# EAGLE design mainboard (EAGLE 7.6.0)
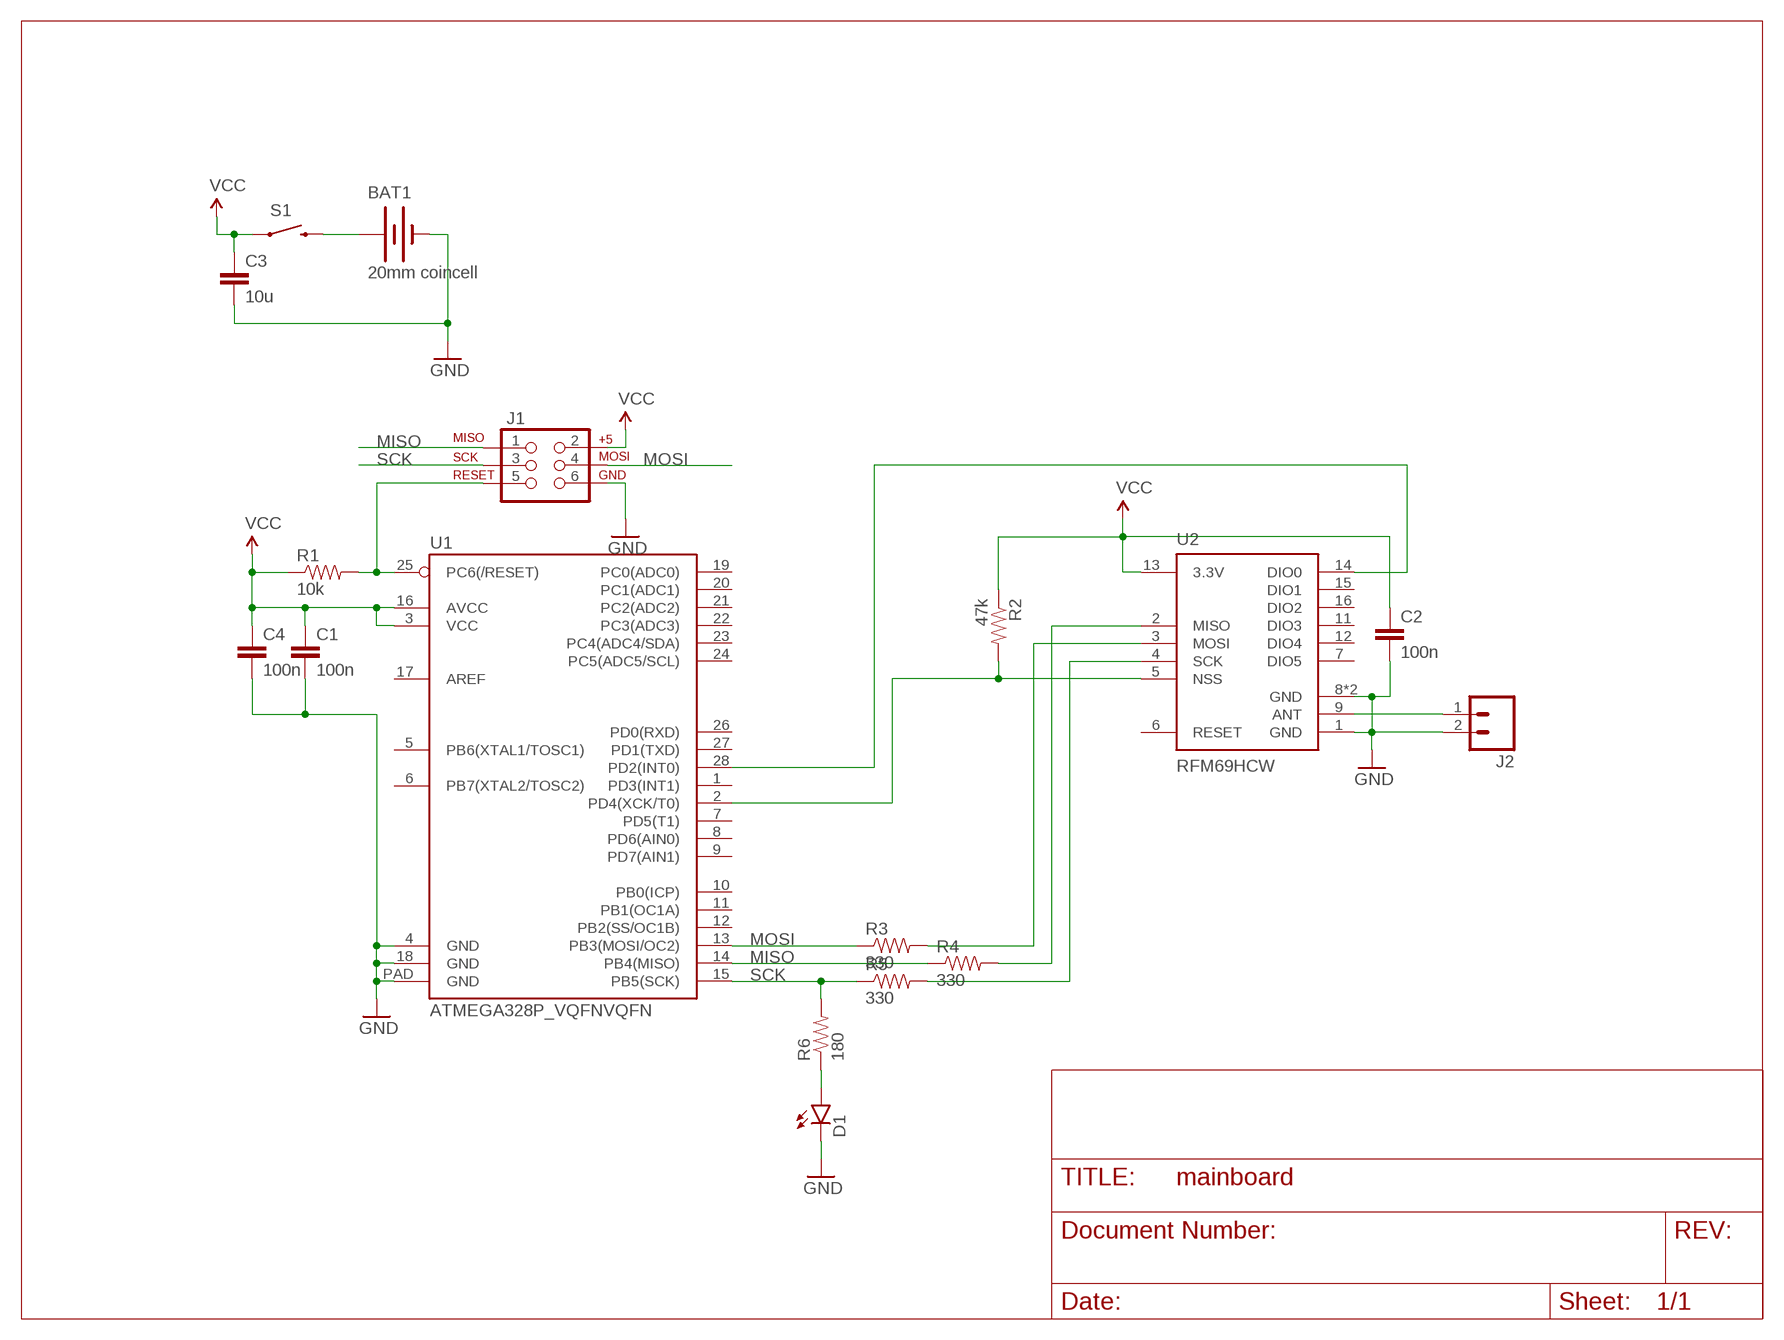
[diagram p0: schematic, sheet 1]

## Parts
BAT1  20mm coincell  BATTERY20MM_4LEGS  [BATTCON_20MM_4LEGS]
C1  100n  CAP0603-CAP  [0603-CAP]
C2  100n  CAP0603-CAP  [0603-CAP]
C3  10u  CAP1206  [1206]
C4  100n  CAP0603-CAP  [0603-CAP]
D1  LED0603  [LED-0603]
J1  AVR_SPI_PRG_6PTH  [2X3]
J2  M02PTH  [1X02]
R1  10k  RESISTOR0603-RES  [0603-RES]
R2  47k  RESISTOR0603-RES  [0603-RES]
R3  330  RESISTOR0603-RES  [0603-RES]
R4  330  RESISTOR0603-RES  [0603-RES]
R5  330  RESISTOR0603-RES  [0603-RES]
R6  180  RESISTOR0603-RES  [0603-RES]
S1  SWITCH-MOMENTARY-2PTH  [TACTILE-PTH]
U1  ATMEGA328P_VQFNVQFN  [VQFN-28]
U2  RFM69HCW  [RFM69HCW-XXXS2]

## Nets
GND: BAT1.NEGATIVE(-) C1.2 C2.2 C3.2 C4.2 D1.C J1.6 J2.2 U1.4(GND) U1.18(GND) U1.PAD(GND) U2.1(GND) U2.8(GND) U2.10(GND)
MISO: J1.1 R4.1 U1.14(PB4(MISO))
MOSI: J1.4 R3.1 U1.13(PB3(MOSI/OC2))
N$1: BAT1.POSITIVE@1(+) BAT1.POSITIVE@2(+) BAT1.POSITIVE@3(+) BAT1.POSITIVE@4(+) S1.3
N$2: J1.5 R1.2 U1.25(PC6(/RESET))
N$3: R3.2 U2.3(MOSI)
N$4: J2.1 U2.9(ANT)
N$5: R4.2 U2.2(MISO)
N$6: R2.2 U1.2(PD4(XCK/T0)) U2.5(NSS)
N$7: R5.2 U2.4(SCK)
N$8: U1.28(PD2(INT0)) U2.14(DIO0)
N$9: D1.A R6.1
SCK: J1.3 R5.1 R6.2 U1.15(PB5(SCK))
VCC: C1.1 C2.1 C3.1 C4.1 J1.2 R1.1 R2.1 S1.1 U1.3(VCC) U1.16(AVCC) U2.13(3.3V)
Unconnected: U1.1(PD3(INT1)) U1.5(PB6(XTAL1/TOSC1)) U1.6(PB7(XTAL2/TOSC2)) U1.7(PD5(T1)) U1.8(PD6(AIN0)) U1.9(PD7(AIN1)) U1.10(PB0(ICP)) U1.11(PB1(OC1A)) U1.12(PB2(SS/OC1B)) U1.17(AREF) U1.19(PC0(ADC0)) U1.20(PC1(ADC1)) U1.21(PC2(ADC2)) U1.22(PC3(ADC3)) U1.23(PC4(ADC4/SDA)) U1.24(PC5(ADC5/SCL)) U1.26(PD0(RXD)) U1.27(PD1(TXD)) U2.6(RESET) U2.7(DIO5) U2.11(DIO3) U2.12(DIO4) U2.15(DIO1) U2.16(DIO2)

## Library data of the parts
BAT1 = SparkFun-Electromechanical:BATTERY: Battery Holders Various common sizes : AA, AAA, 18650 (PRT-12895), 20mm coin cell and 12mm coin cell. 20MM_4LEGS, BATT-10373; PROD_ID: BATT-10373
C1-C4 = SparkFun-Passives:CAP: Capacitor Standard 0603 ceramic capacitor, and 0.1" leaded capacitor.
D1 = SparkFun-LED:LED: LEDs Standard schematic elements and footprints for 5mm, 3mm, 1206, and 0603 sized LEDs. 5mm - Spark Fun Electronics SKU : COM-00529 (and others)
J1 = SparkFun-Connectors:AVR_SPI_PRG_6: AVR ISP 6 Pin This is the reduced ISP connector for AVR programming. Common on Arduino. This footprint will take up less PCB space and can be used with a 10-pin to 6-pin adapter such as SKU: BOB-08508 **Special note about "TEST_POINT" package. The stop mask is on the top side, so if you want your programming test points to be on the bottom of your board, make sure to place this package on the bottom side of the board. This also ensure that the orientation to program from the bottom side will be correct.
J2 = SparkFun-Connectors:M02: Standard 2-pin 0.1" header. Use with - straight break away headers ( PRT-00116) - right angle break away headers (PRT-00553) - swiss pins (PRT-00743) - machine pins (PRT-00117) - female headers (PRT-00115) Molex polarized connector foot print use with: PRT-08233 with associated crimp pins and housings. 2.54_SCREWTERM for use with PRT-10571. 3.5mm Screw Terminal footprints for PRT-08084 5mm Screw Terminal footprints for use with PRT-08432
R1-R6 = SparkFun-Passives:RESISTOR: Resistor Basic schematic elements and footprints for 0603, 1206, and PTH resistors.
S1 = SparkFun-Electromechanical:SWITCH-MOMENTARY-2: Various NO switches- pushbuttons, reed, etc; PROD_ID: SWCH-08441
U1 = SparkFun-DigitalIC:ATMEGA328P_VQFN
U2 = SparkFun-RF:RFM69H; PROD_ID: IC-11997, IC-12053

## Net classes
0 default: clearance 0.205 mm

## Board
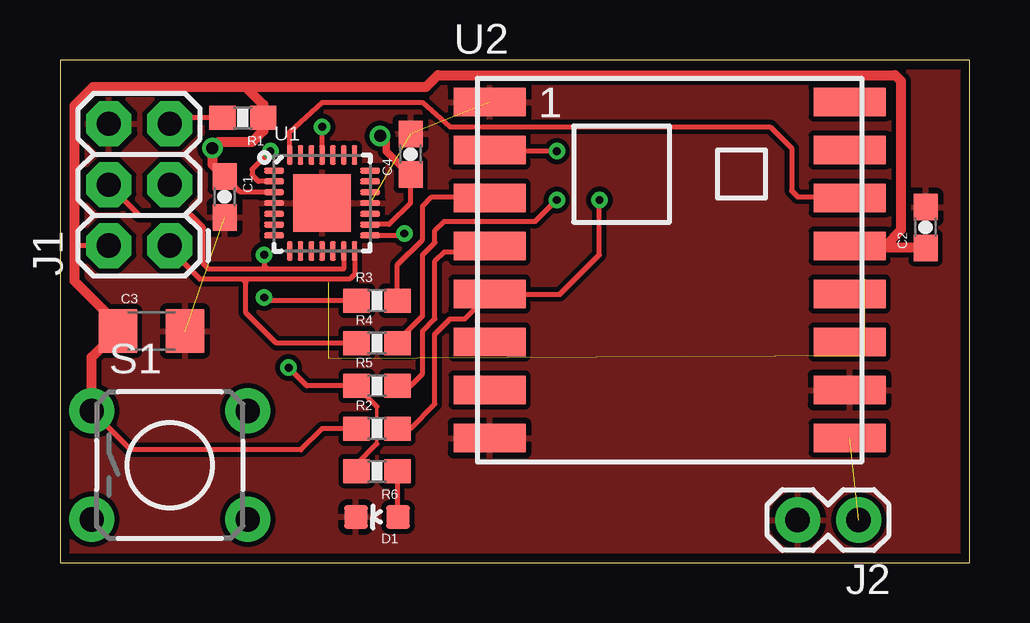
[diagram p1: board, top side]
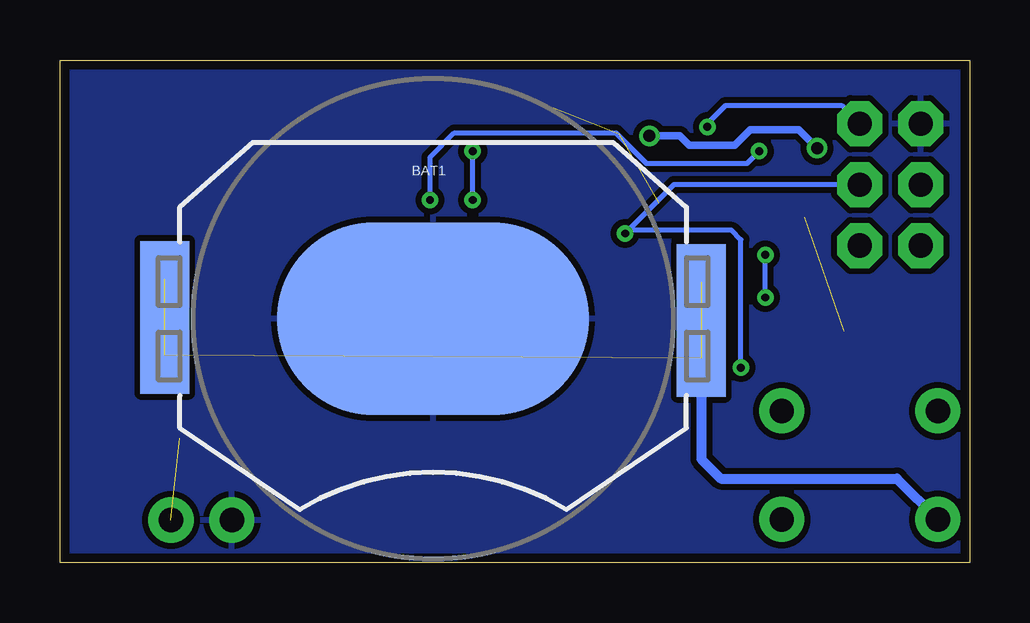
[diagram p2: board, bottom side, seen from below]

Size 37.9 x 20.95 mm. Coordinates in mm from the lower left corner, seen from the top.
Outline: 0,0 37.9,0 37.9,20.95 0,20.95 0,0
Copper layers (1*16): Top 0.035mm / dielectric 1.5mm / Bottom 0.035mm
Design rules "default *": minimum track width 6mil, minimum drill 13mil, track to track 6mil, track to pad 6mil, pad to pad 6mil, via to via 6mil, smd to smd 6mil, copper to edge 15mil, drill to drill 8mil, minimum pad ring 10mil, minimum via ring 7mil, stop-mask expansion 4mil, vias tented up to drill 0mil, thermal gap 10mil

### Footprints (pad centres in the part's own frame; a part is rotated, then mirrored left to right if it is on the bottom)
BATTCON_20MM_4LEGS = smd 13 x 8: NEGATIVE 0,0 | smd 2.032 x 3.175: POSITIVE@1 -11.176,1.651; POSITIVE@2 -11.176,-1.524; POSITIVE@3 11.176,1.524; POSITIVE@4 11.176,-1.651
0603-CAP = smd 1.1 x 1: 1 -0.85,0; 2 0.85,0
1206 = smd 1.6 x 1.8: 1 -1.4,0; 2 1.4,0
LED-0603 = smd 1 x 1: A 0,-0.877; C 0,0.877
2X3 = drill 1.016 pad 1.88 octagon: 1 0,0; 2 0,2.54; 3 2.54,0; 4 2.54,2.54; 5 5.08,0; 6 5.08,2.54
1X02 = drill 1.016 pad 1.88: 1 0,0; 2 2.54,0
0603-RES = smd 1.1 x 1: 1 -0.85,0; 2 0.85,0
TACTILE-PTH = drill 1.016 pad 1.88: 1 -3.251,2.261; 2 3.251,2.261; 3 -3.251,-2.261; 4 3.251,-2.261
VQFN-28 = smd 0.82 x 0.24: 1 -2,1.35; 2 -2,0.9; 3 -2,0.45; 4 -2,0; 5 -2,-0.45; 6 -2,-0.9; 7 -2,-1.35; 15 2,-1.35; 16 2,-0.9; 17 2,-0.45; 18 2,0; 19 2,0.45; 20 2,0.9; 21 2,1.35 | smd 0.24 x 0.82: 8 -1.35,-2; 9 -0.9,-2; 10 -0.45,-2; 11 0,-2; 12 0.45,-2; 13 0.9,-2; 14 1.35,-2; 22 1.35,2; 23 0.9,2; 24 0.45,2; 25 0,2; 26 -0.45,2; 27 -0.9,2; 28 -1.35,2 | smd 2.4 x 2.4: PAD 0,0
RFM69HCW-XXXS2 = smd 3 x 1.2: 1 -7.5,7; 2 -7.5,5; 3 -7.5,3; 4 -7.5,1; 5 -7.5,-1; 6 -7.5,-3; 7 -7.5,-5; 8 -7.5,-7; 9 7.5,-7; 10 7.5,-5; 11 7.5,-3; 12 7.5,-1; 13 7.5,1; 14 7.5,3; 15 7.5,5; 16 7.5,7

### Placement (x,y rotation side)
BAT1  22.35,10.16 0 bottom
C1  6.86,15.24 270 top
C2  36.07,13.97 90 top
C3  3.81,9.65 0 top
C4  14.61,17.02 90 top
D1  13.21,1.91 90 top
J1  4.57,13.21 90 top
J2  33.27,1.78 180 top
R1  7.62,18.54 180 top
R2  13.21,5.59 0 top
R3  13.21,10.92 0 top
R4  13.21,9.14 0 top
R5  13.21,7.37 0 top
R6  13.21,3.81 180 top
S1  4.57,4.06 0 top
U1  10.92,14.99 0 top
U2  25.4,12.19 0 top

### Tracks (layer width: path | path; a pad name or v marks a point on that pad's centre or on a via)
GND  (3 unrouted)
  pour Top: 0,20.95 37.97,20.95 37.97,0 0,0
  pour Bottom (isolate 0.254): 0,0 0,20.95 37.97,20.95 37.97,0
MISO
  Top 0.203: J1.1 4.57,13.08 5.84,11.81 7.62,11.81 | U1.14 12.27,12.02 12.06,11.81 7.62,11.81 | R4.1 9.02,9.14 7.75,10.41 7.75,11.68 7.62,11.81
MOSI  (via drill 0.33)
  Top 0.203: J1.4 3.3,14.48 5.46,14.48 5.97,13.97 5.97,12.45 6.17,12.24 8.64,12.24 | 8.64,12.24 11.81,12.24 11.82,12.25 U1.13 | R3.1 8.64,10.92 v8.51,11.05 | v8.51,12.83 8.51,12.37 8.64,12.24
  Bottom 0.203: v8.51,11.05 v8.51,12.83
N$1  (3 unrouted)
  Bottom 0.406: BAT1.POSITIVE@3 11.18,4.32 10.36,3.5 3.02,3.5 S1.3
N$2  (via drill 0.33)
  Top 0.203: R1.2 4.83,18.54 J1.5 | U1.25 v10.92,18.16
  Bottom 0.203: J1.5 5.33,19.05 10.16,19.05 10.92,18.29 v10.92,18.16
N$3
  Top 0.203: R3.2 14.06,12.41 15.11,13.46 15.11,14.86 15.49,15.24 17.85,15.24 U2.3
N$4  (1 unrouted)
N$5  (via drill 0.33)
  Top 0.203: R4.2 14.06,9.23 15.11,10.29 15.11,12.83 15.62,13.34 15.62,13.84 16,14.22 19.81,14.22 v20.7,15.11 | v20.7,17.14 17.95,17.14 U2.2
  Bottom 0.203: v20.7,15.11 v20.7,17.14
N$6  (via drill 0.33)
  Top 0.203: R2.2 14.61,5.59 15.62,6.6 15.62,9.53 16.26,10.16 16.87,10.16 U2.5 17.92,11.18 20.83,11.18 22.48,12.83 v22.48,15.11 | U1.2 8.27,15.89 8,16.15 8,16.38 v8.76,17.14
  Bottom 0.203: v22.48,15.11 22.48,16.89 21.46,17.91 14.73,17.91 13.46,16.64 9.27,16.64 v8.76,17.14
N$7
  Top 0.203: R5.2 14.61,7.37 15.11,7.87 15.11,9.65 15.62,10.16 15.62,12.57 16,12.95 17.66,12.95 U2.4
N$8
  Top 0.203: U1.28 9.57,17.95 10.92,19.18 15.11,19.18 16.26,18.16 29.59,18.16 30.48,17.27 30.48,15.49 30.73,15.24 32.85,15.24 U2.14
N$9
  Top 0.203: R6.1 14.06,1.93 D1.A
SCK  (via drill 0.33)
  Top 0.152: 13.21,4.95 13.21,6.52
  Top 0.203: U1.15 14.27,13.64 v14.35,13.72 | R6.2 12.36,4.1 13.21,4.95 | 13.21,6.52 R5.1 10.29,7.37 v9.53,8.13
  Bottom 0.203: J1.3 12.32,15.75 v14.35,13.72 14.22,13.84 9.91,13.84 9.53,13.46 v9.53,8.13
VCC  (via drill 0.5)
  Top 0.203: J1.2 0.74,13.21 0.61,13.34 | R2.1 10.92,5.59 10.03,4.7 2.95,4.7 S1.1 | U1.16 12.93,14.1 13.72,14.1 14.61,14.99 C4.1 | U1.3 7.51,15.44 C1.1
  Top 0.305: C4.1 14.57,16.17 13.59,17.14 13.59,17.53 v13.34,17.78
  Top 0.406: S1.1 1.32,8.56 C3.1 2.41,9.93 0.61,11.73 0.61,13.34 0.61,19.05 1.37,19.81 7.75,19.81 | C2.1 32.97,13.12 U2.13 34.38,13.19 35.05,13.87 35.05,20.07 34.8,20.32 15.75,20.32 15.24,19.81 7.75,19.81 | 7.75,19.81 8.47,19.09 R1.1 8.47,18 8,17.53 6.6,17.53 v6.35,17.27 6.35,16.6 C1.1
  Bottom 0.305: v13.34,17.78 12.06,17.78 11.68,17.4 9.78,17.4 9.14,18.03 7.11,18.03 v6.35,17.27